# EAGLE design 7Segment (EAGLE 5.11)
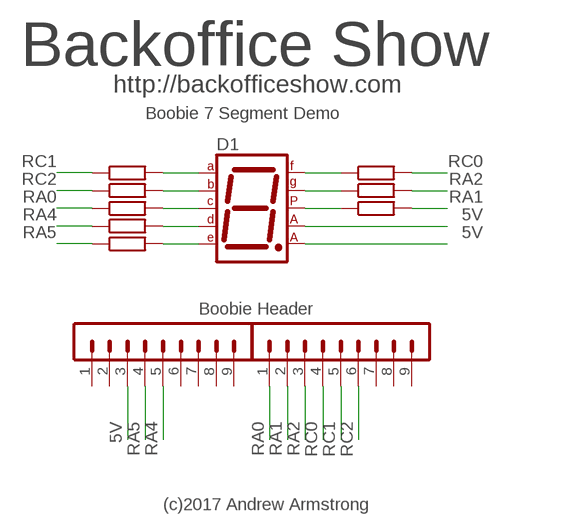
[diagram p0: schematic, sheet 1]

## Parts
D1  7SEG-CA  [7SEG-13]
R1  330R  R-EU_0207/10  [0207/10]
R2  330R  R-EU_0207/10  [0207/10]
R3  330R  R-EU_0207/10  [0207/10]
R4  330R  R-EU_0207/10  [0207/10]
R5  330R  R-EU_0207/10  [0207/10]
R6  330R  R-EU_0207/10  [0207/10]
R7  330R  R-EU_0207/10  [0207/10]
R8  330R  R-EU_0207/10  [0207/10]
SV1  MA09-1  [MA09-1]
SV2  MA09-1  [MA09-1]

## Nets
5V: D1.3(CA1) D1.8(CA2) SV2.3
N$1: D1.7(A) R1.2
N$2: D1.6(B) R2.2
N$3: D1.4(C) R3.2
N$4: D1.2(D) R4.2
N$5: D1.1(E) R5.2
N$6: D1.9(F) R6.1
N$7: D1.10(G) R7.1
N$8: D1.5(DP) R8.1
RA0: R3.1 SV1.1
RA1: R8.2 SV1.2
RA2: R7.2 SV1.3
RA4: R4.1 SV2.5
RA5: R5.1 SV2.4
RC0: R6.2 SV1.4
RC1: R1.1 SV1.5
RC2: R2.1 SV1.6
Unconnected: SV1.7 SV1.8 SV1.9 SV2.1 SV2.2 SV2.6 SV2.7 SV2.8 SV2.9

## Notes on the sheet
- Backoffice Show
- http://backofficeshow.com
- Boobie 7 Segment Demo
- Boobie Header
- (c)2017 Andrew Armstrong

## Library data of the parts
D1 = special:7SEG-CA: 7-segment DISPLAY single anode, 13 mm
R1-R8 = rcl:R-EU_: RESISTOR, European symbol
SV1 SV2 = con-lstb:MA09-1: PIN HEADER; OC_FARNELL: unknown; OC_NEWARK: unknown

## Net classes
0 default: width 0.5 mm

## Board
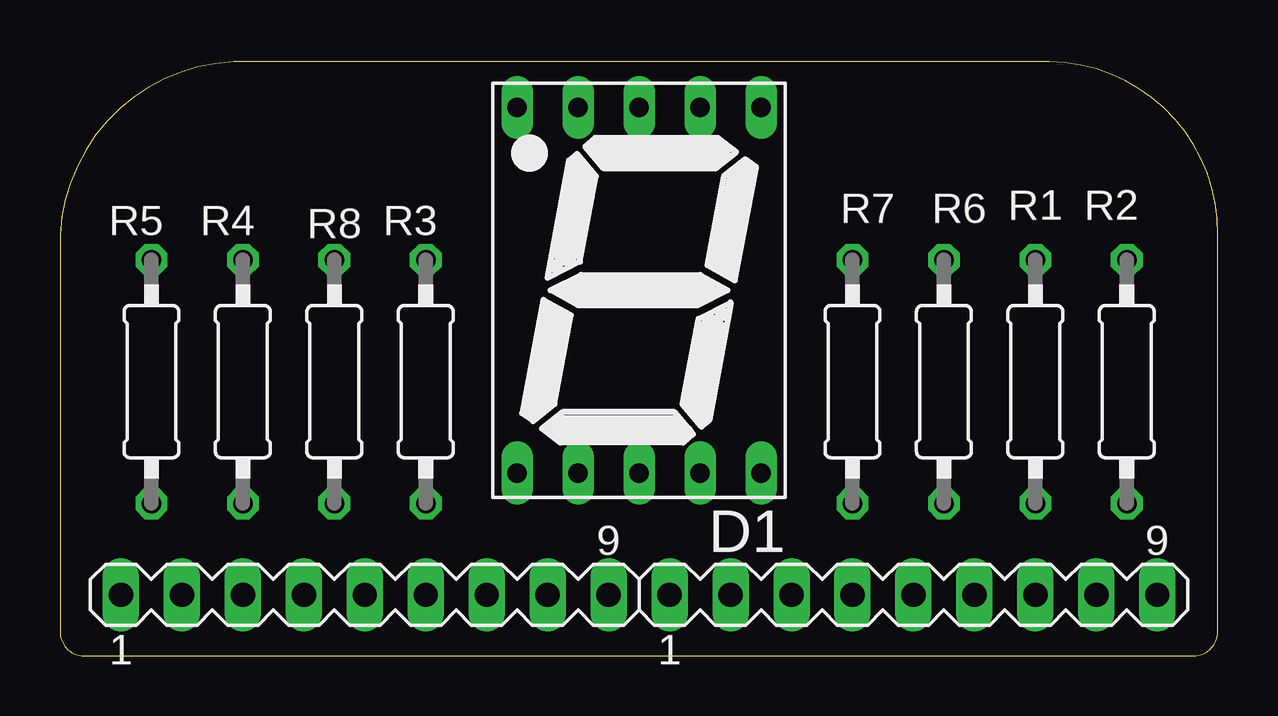
[diagram p1: board, top side]
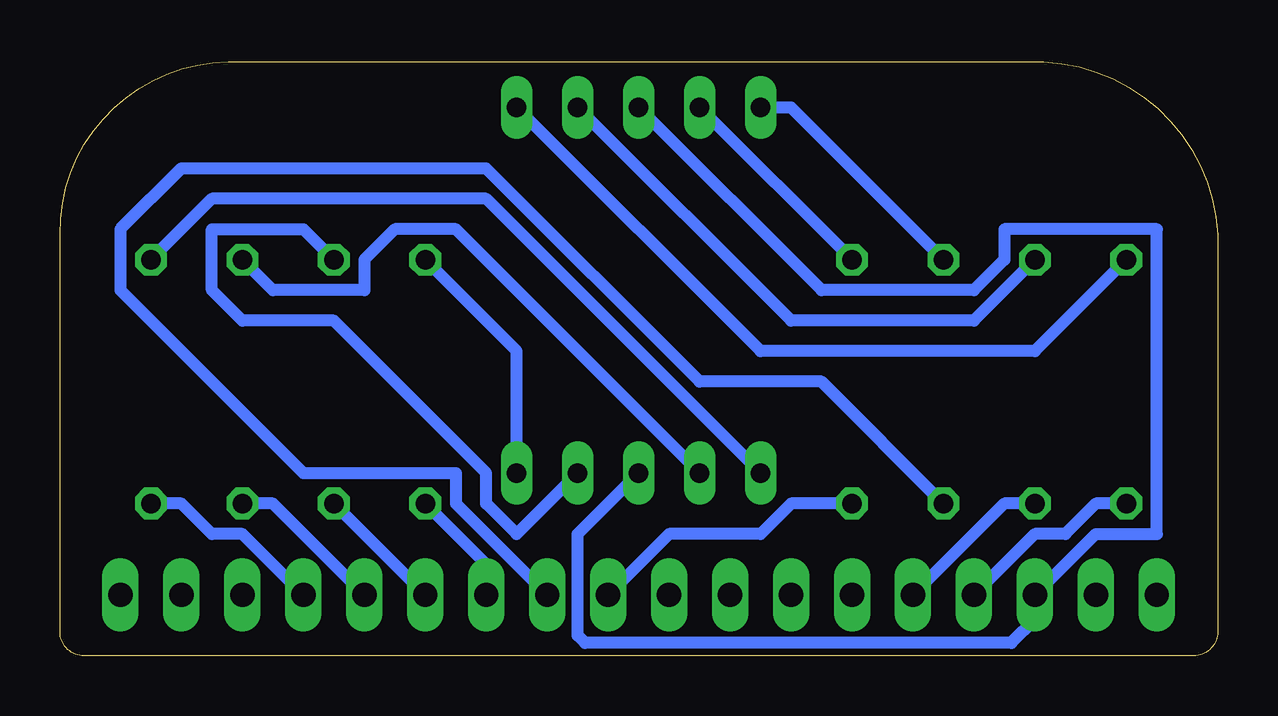
[diagram p2: board, bottom side, seen from below]

Size 48.24 x 24.77 mm. Coordinates in mm from the lower left corner, seen from the top.
Outline: 47.24,0 arc90 48.24,1 48.24,17.57 arc90 41.23,24.77 7.99,24.77 arc90 0,17.57 0,1 arc90 1,0 47.24,0
Copper layers (1*16): Top 0.035mm / dielectric 1.5mm / Bottom 0.035mm
Design rules "default": minimum track width 10mil, minimum drill 24mil, track to track 8mil, track to pad 8mil, pad to pad 8mil, via to via 8mil, smd to smd 8mil, copper to edge 40mil, drill to drill 8mil, minimum pad ring 10mil, minimum via ring 8mil, stop-mask expansion 4mil, vias tented up to drill 0mil, thermal gap 10mil

### Footprints (pad centres in the part's own frame; a part is rotated, then mirrored left to right if it is on the bottom)
7SEG-13 = drill 0.813 long: 1 -5.08,-7.62; 2 -2.54,-7.62; 3 0,-7.62; 4 2.54,-7.62; 5 5.08,-7.62; 6 5.08,7.62; 7 2.54,7.62; 8 0,7.62; 9 -2.54,7.62; 10 -5.08,7.62
0207/10 = drill 0.813 octagon: 1 -5.08,0; 2 5.08,0
MA09-1 = drill 1.016 long: 1 -10.16,0; 2 -7.62,0; 3 -5.08,0; 4 -2.54,0; 5 0,0; 6 2.54,0; 7 5.08,0; 8 7.62,0; 9 10.16,0

### Placement (x,y rotation side)
D1  24.13,15.24 180 top
R1  40.64,11.43 90 top
R2  44.45,11.43 90 top
R3  15.24,11.43 90 top
R4  7.62,11.43 90 top
R5  3.81,11.43 90 top
R6  36.83,11.43 270 top
R7  33.02,11.43 270 top
R8  11.43,11.43 270 top
SV1  35.56,2.54 0 top
SV2  12.7,2.54 0 top

### Tracks (layer width: path | path; a pad name or v marks a point on that pad's centre or on a via)
5V
  Bottom 0.5: D1.8 26.67,5.08 26.67,0.85 26.36,0.54 8.6,0.54 7.6,1.53 7.6,2.53 SV2.3 5.08,5.08 2.54,5.08 2.54,17.78 8.89,17.78 8.89,16.51 10.16,15.24 16.51,15.24 D1.3
N$1
  Bottom 0.5: D1.7 31.75,17.78 34.29,17.78 35.56,16.51 35.56,15.24 39.37,15.24 R1.2
N$2
  Bottom 0.5: D1.6 30.48,19.05 41.91,19.05 R2.2
N$3
  Bottom 0.5: R3.2 D1.4
N$4
  Bottom 0.5: R4.2 10.16,13.97 17.78,13.97 D1.2
N$5
  Bottom 0.5: R5.2 7.62,12.7 19.05,12.7 D1.1
N$6
  Bottom 0.5: D1.9 29.21,5.08 30.48,6.35 30.48,7.62 36.83,13.97 40.64,13.97 41.91,15.24 41.91,17.78 38.1,17.78 R6.1
N$7
  Bottom 0.5: D1.10 29.21,12.7 R7.1
N$8
  Bottom 0.5: R8.1 17.78,22.86 D1.5
RA0
  Bottom 0.5: R3.1 17.78,6.35 19.05,5.08 22.86,5.08 SV1.1
RA1
  Bottom 0.5: R8.2 16.51,11.43 21.59,11.43 30.48,20.32 43.18,20.32 45.72,17.78 45.72,15.24 38.1,7.62 31.75,7.62 31.75,6.35 SV1.2
RA2
  Bottom 0.5: R7.2 30.48,3.81 SV1.3
RA4
  Bottom 0.5: R4.1 8.89,6.35 SV2.5
RA5
  Bottom 0.5: R5.1 5.08,6.35 6.35,5.08 7.62,5.08 SV2.4
RC0
  Bottom 0.5: SV1.4 R6.2
RC1
  Bottom 0.5: R1.1 39.37,6.35 SV1.5
RC2
  Bottom 0.5: R2.1 43.18,6.35 41.91,5.08 40.64,5.08 SV1.6